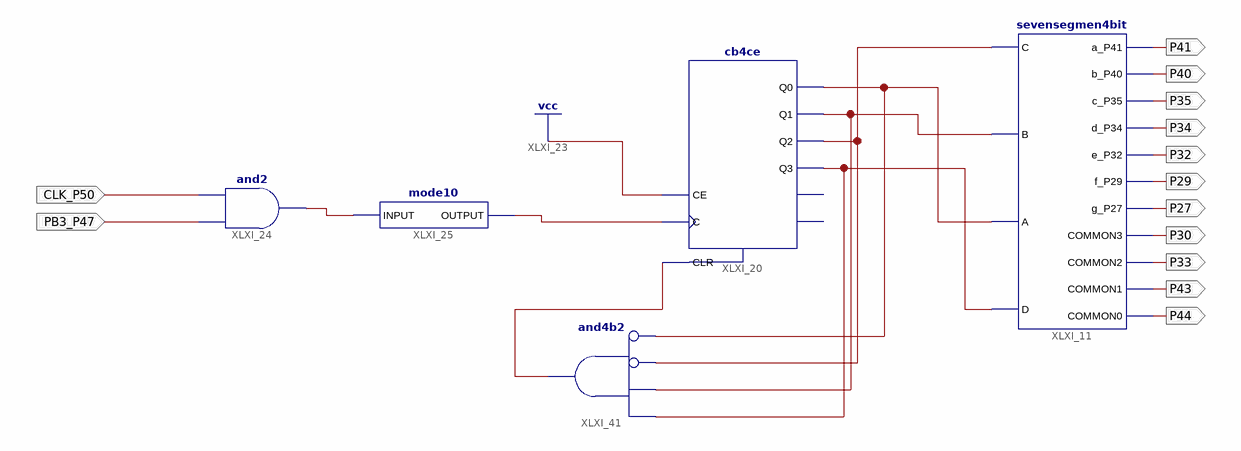
[diagram p0: schematic sheet 1]
// Xilinx ISE schematic Lab5_3.sch (spartan6) as structural Verilog: 5 symbols, 13 ports
module Lab5_3 (
  input  PB3_P47,
  input  CLK_P50,
  output P41,
  output P40,
  output P35,
  output P34,
  output P32,
  output P29,
  output P27,
  output P30,
  output P33,
  output P43,
  output P44
);

  wire XLXN_64, XLXN_71, XLXN_72, XLXN_93, XLXN_95, XLXN_96, XLXN_97;

  sevensegmen4bit XLXI_11 (
    .C(XLXN_97), .B(XLXN_95), .A(XLXN_96), .D(XLXN_93), .a_P41(P41), .b_P40(P40), .c_P35(P35), .d_P34(P34),
    .e_P32(P32), .f_P29(P29), .g_P27(P27), .COMMON3(P30), .COMMON2(P33), .COMMON1(P43), .COMMON0(P44));
  cb4ce XLXI_20 (
    .C(XLXN_71), .CE(1'b1), .CLR(XLXN_72), .Q0(XLXN_96), .Q1(XLXN_95), .Q2(XLXN_97), .Q3(XLXN_93));  // open: CEO, TC
  and XLXI_24 (XLXN_64, PB3_P47, CLK_P50);
  mode10 XLXI_25 (.INPUT(XLXN_64), .OUTPUT(XLXN_71));
  and XLXI_41 (XLXN_72, ~XLXN_96, ~XLXN_97, XLXN_95, XLXN_93);  // and4b2
endmodule
